# Altium project CamController3.PrjPcb
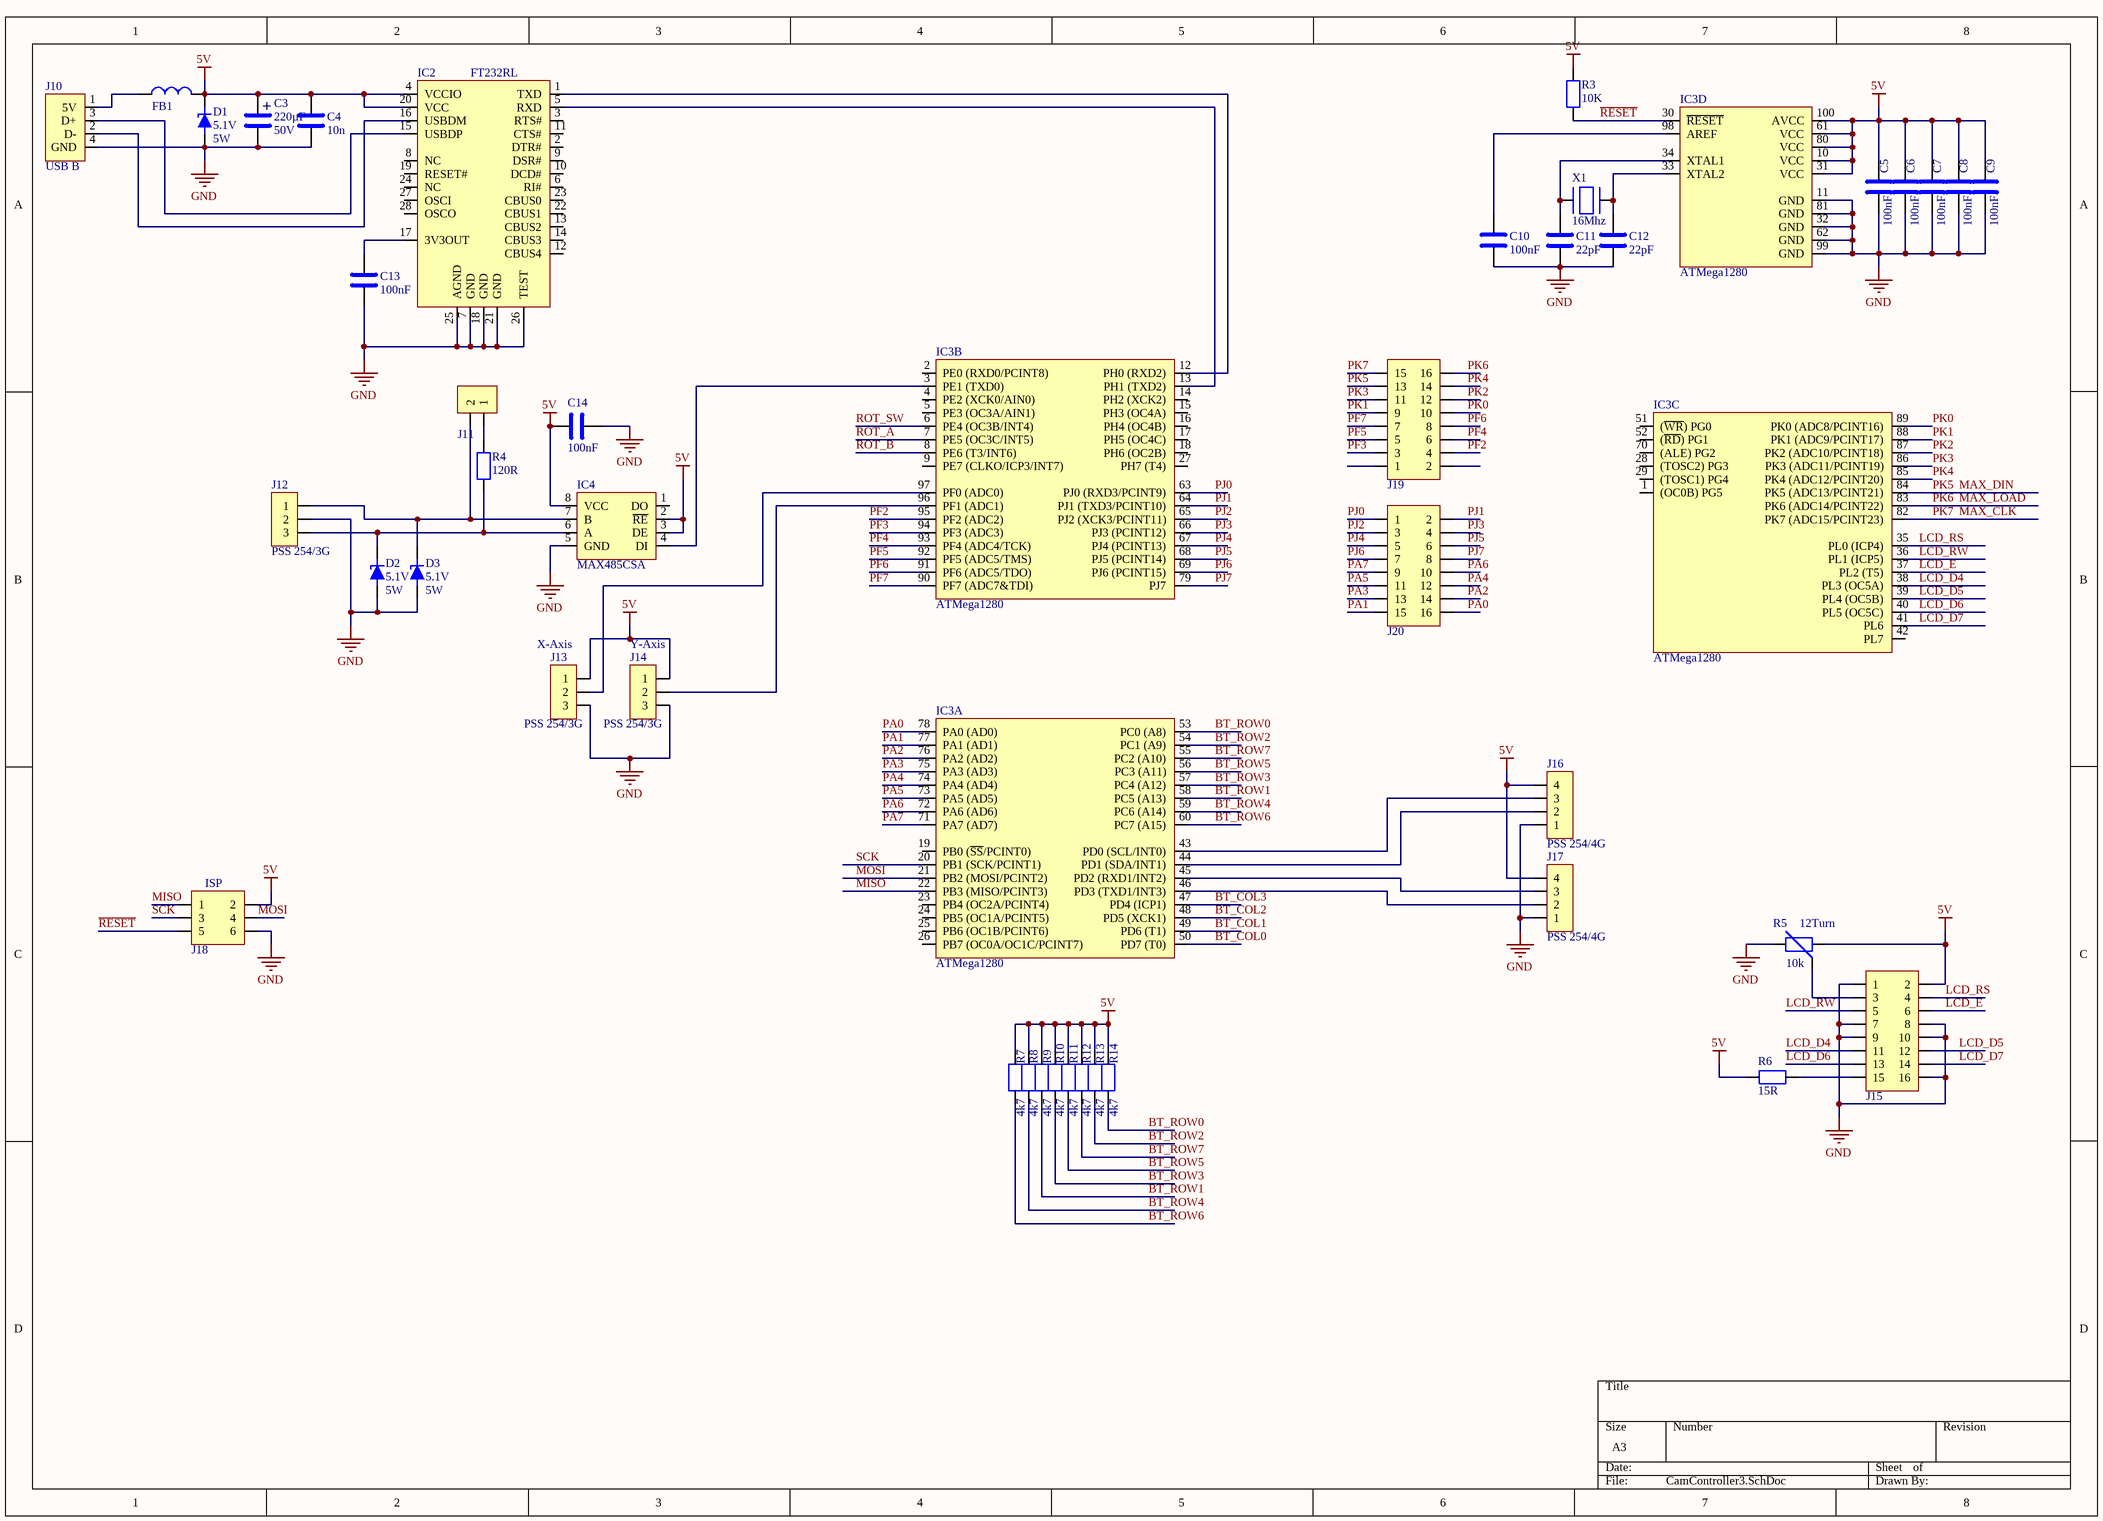
[diagram p0: CamController3.SchDoc]
2 sheets, 57 parts. Net scope: global (net labels, ports and power ports of the same name join across sheets).
Board file: CamController3.PcbDoc
Sheets:
  CamController3.SchDoc
  Buttoninterface.SchDoc

## Sheet CamController3.SchDoc
size A3

### Parts
C3  value 220µF  voltage: 50V  [RM5D125H20]  (hidden comment: Elko_220uF_50V)
C4  value 10n  [0805]  (hidden comment: 10nF 50V MLCC 0805)
C5  value 100nF  [0805]  (hidden comment: 100nF 50V MLCC 0805)
C6  value 100nF  [0805]  (hidden comment: 100nF 50V MLCC 0805)
C7  value 100nF  [0805]  (hidden comment: 100nF 50V MLCC 0805)
C8  value 100nF  [0805]  (hidden comment: 100nF 50V MLCC 0805)
C9  value 100nF  [0805]  (hidden comment: 100nF 50V MLCC 0805)
C10  value 100nF  [0805]  (hidden comment: 100nF 50V MLCC 0805)
C11  value 22pF  [0805]  (hidden comment: 22pF 50V MLCC 0805)
C12  value 22pF  [0805]  (hidden comment: 22pF 50V MLCC 0805)
C13  value 100nF  [0805]  (hidden comment: 100nF 50V MLCC 0805)
C14  value 100nF  [0805]  (hidden comment: 100nF 50V MLCC 0805)
D1  voltage: 5.1V  power: 5W  [DO-204AF]  (hidden comment: ZD-5W 5,1V)
D2  voltage: 5.1V  power: 5W  [DO-204AF]  (hidden comment: ZD-5W 5,1V)
D3  voltage: 5.1V  power: 5W  [DO-204AF]  (hidden comment: ZD-5W 5,1V)
FB1  Feritbead  [Ferritbead]  (value not drawn)
IC2  FT232RL  [SSOP-28]
IC3  ATMega1280  [LQFP100]  (parts A,B,C,D of 4)
IC4  MAX485CSA  [SOIC8]
J10  USB B  [USB_B]
J11  SL 1X2G 2,54  [SL_1x2 2.54mm]  (value not drawn)
J12  PSS 254/3G  [PSS 3pol]
J13  PSS 254/3G  [PSS 3pol]
J14  PSS 254/3G  [PSS 3pol]
J15  Wannenstecker 16pol 2,54mm  [WSL16G]  (value not drawn)
J16  PSS 254/4G  [PSS 4pol]
J17  PSS 254/4G  [PSS 4pol]
J18  Wannenstecker 6pol 2,54mm  [WSL6G]  (value not drawn)
J19  Wannenstecker 16pol 2,54mm  [WSL16G]  (value not drawn)
J20  Wannenstecker 16pol 2,54mm  [WSL16G]  (value not drawn)
R3  value 10K  [res0805]  (hidden comment: 10K 125mW 0805)
R4  value 120R  [res0805]  (hidden comment: 120R 125mW 0805)
R5  12Turn  value 10k  [64W]
R6  value 15R  [res0805]  (hidden comment: 15R 125mW 0805)
R7  value 4k7  [res0805]  (hidden comment: 4k7 125mW 0805)
R8  value 4k7  [res0805]  (hidden comment: 4k7 125mW 0805)
R9  value 4k7  [res0805]  (hidden comment: 4k7 125mW 0805)
R10  value 4k7  [res0805]  (hidden comment: 4k7 125mW 0805)
R11  value 4k7  [res0805]  (hidden comment: 4k7 125mW 0805)
R12  value 4k7  [res0805]  (hidden comment: 4k7 125mW 0805)
R13  value 4k7  [res0805]  (hidden comment: 4k7 125mW 0805)
R14  value 4k7  [res0805]  (hidden comment: 4k7 125mW 0805)
X1  Frequency: 16Mhz  [HC49]  (hidden comment: 8Mhz_HC49U)

### Nets
5V: C3.+ C4.1 C5.2 C6.2 C7.2 C8.2 C9.2 C14.1 D1.1 FB1.2 IC2.4(VCCIO) IC2.20(VCC) IC3.10(VCC) IC3.31(VCC) IC3.61(VCC) IC3.80(VCC) IC3.100(AVCC) IC4.2(~{RE}) IC4.3(DE) IC4.8(VCC) J13.1 J14.1 J15.2 J16.4 J17.4 J18.2 R3.2 R5.3 R6.2 R7.2 R8.2 R9.2 R10.2 R11.2 R12.2 R13.2 R14.2
GND: C3.- C4.2 C5.1 C6.1 C7.1 C8.1 C9.1 C10.1 C11.2 C12.2 C13.2 C14.2 D1.2 D2.2 D3.2 IC2.7(GND) IC2.18(GND) IC2.21(GND) IC2.25(AGND) IC2.26(TEST) IC3.11(GND) IC3.32(GND) IC3.62(GND) IC3.81(GND) IC3.99(GND) IC4.5(GND) J10.4(GND) J12.2 J13.3 J14.3 J15.1 J15.7 J15.8 J15.9 J15.10 J15.16 J16.1 J17.1 J18.6 R5.1
BT_COL0: IC3.50(PD7_(T0))
BT_COL1: IC3.49(PD6_(T1))
BT_COL2: IC3.48(PD5_(XCK1))
BT_COL3: IC3.47(PD4_(ICP1))
BT_ROW0: IC3.53(PC0_(A8)) R14.1
BT_ROW1: IC3.58(PC5_(A13)) R9.1
BT_ROW2: IC3.54(PC1_(A9)) R13.1
BT_ROW3: IC3.57(PC4_(A12)) R10.1
BT_ROW4: IC3.59(PC6_(A14)) R8.1
BT_ROW5: IC3.56(PC3_(A11)) R11.1
BT_ROW6: IC3.60(PC7_(A15)) R7.1
BT_ROW7: IC3.55(PC2_(A10)) R12.1
LCD_D4: IC3.38(PL3_(OC5A)) J15.11
LCD_D5: IC3.39(PL4_(OC5B)) J15.12
LCD_D6: IC3.40(PL5_(OC5C)) J15.13
LCD_D7: IC3.41(PL6) J15.14
LCD_E: IC3.37(PL2_(T5)) J15.6
LCD_RS: IC3.35(PL0_(ICP4)) J15.4
LCD_RW: IC3.36(PL1_(ICP5)) J15.5
MAX_CLK: IC3.82(PK7_(ADC15/PCINT23)) J19.15  [also labelled PK7]
MAX_DIN: IC3.84(PK5_(ADC13/PCINT21)) J19.13  [also labelled PK5]
MAX_LOAD: IC3.83(PK6_(ADC14/PCINT22)) J19.16  [also labelled PK6]
MISO: IC3.22(PB3_(MISO/PCINT3)) J18.1
MOSI: IC3.21(PB2_(MOSI/PCINT2)) J18.4
PA0: IC3.78(PA0_(AD0)) J20.16
PA1: IC3.77(PA1_(AD1)) J20.15
PA2: IC3.76(PA2_(AD2)) J20.14
PA3: IC3.75(PA3_(AD3)) J20.13
PA4: IC3.74(PA4_(AD4)) J20.12
PA5: IC3.73(PA5_(AD5)) J20.11
PA6: IC3.72(PA6_(AD6)) J20.10
PA7: IC3.71(PA7_(AD7)) J20.9
PF2: IC3.95(PF2_(ADC2)) J19.4
PF3: IC3.94(PF3_(ADC3)) J19.3
PF4: IC3.93(PF4_(ADC4/TCK)) J19.6
PF5: IC3.92(PF5_(ADC5/TMS)) J19.5
PF6: IC3.91(PF6_(ADC5/TDO)) J19.8
PF7: IC3.90(PF7_(ADC7&TDI)) J19.7
PJ0: IC3.63(PJ0_(RXD3/PCINT9)) J20.1
PJ1: IC3.64(PJ1_(TXD3/PCINT10)) J20.2
PJ2: IC3.65(PJ2_(XCK3/PCINT11)) J20.3
PJ3: IC3.66(PJ3_(PCINT12)) J20.4
PJ4: IC3.67(PJ4_(PCINT13)) J20.5
PJ5: IC3.68(PJ5_(PCINT14)) J20.6
PJ6: IC3.69(PJ6_(PCINT15)) J20.7
PJ7: IC3.79(PJ7) J20.8
PK0: IC3.89(PK0_(ADC8/PCINT16)) J19.10
PK1: IC3.88(PK1_(ADC9/PCINT17)) J19.9
PK2: IC3.87(PK2_(ADC10/PCINT18)) J19.12
PK3: IC3.86(PK3_(ADC11/PCINT19)) J19.11
PK4: IC3.85(PK4_(ADC12/PCINT20)) J19.14
~{RESET}: IC3.30(~{RESET}) J18.5 R3.1
ROT_A: IC3.7(PE5_(OC3C/INT5))
ROT_B: IC3.8(PE6_(T3/INT6))
ROT_SW: IC3.6(PE4_(OC3B/INT4))
SCK: IC3.20(PB1_(SCK/PCINT1)) J18.3
NetC10_2: C10.2 IC3.98(AREF)
NetC11_1: C11.1 IC3.34(XTAL1) X1.1
NetC12_1: C12.1 IC3.33(XTAL2) X1.2
NetC13_1: C13.1 IC2.17(3V3OUT)
NetD2_1: D2.1 IC4.6(A) J12.3 R4.1
NetD3_1: D3.1 IC4.7(B) J11.2 J12.1
NetFB1_1: FB1.1 J10.1(5V)
NetIC2_1: IC2.1(TXD) IC3.12(PH0_(RXD2))
NetIC2_5: IC2.5(RXD) IC3.13(PH1_(TXD2))
NetIC2_15: IC2.15(USBDP) J10.3(D+)
NetIC2_16: IC2.16(USBDM) J10.2(D-)
NetIC3_3: IC3.3(PE1_(TXD0)) IC4.4(DI)
NetIC3_43: IC3.43(PD0_(SCL/INT0)) J16.3
NetIC3_44: IC3.44(PD1_(SDA/INT1)) J16.2
NetIC3_45: IC3.45(PD2_(RXD1/INT2)) J17.3
NetIC3_46: IC3.46(PD3_(TXD1/INT3)) J17.2
NetIC3_96: IC3.96(PF1_(ADC1)) J14.2
NetIC3_97: IC3.97(PF0_(ADC0)) J13.2
NetJ11_1: J11.1 R4.2
NetJ15_3: J15.3 R5.2
NetJ15_15: J15.15 R6.1

Not connected (* = marked no-connect by the designer): IC2 2(DTR#) 3(RTS#) 6(RI#) 8(NC) 9(DSR#) 10(DCD#) 11(CTS#) 12(CBUS4) 13(CBUS2) 14(CBUS3) 19(RESET#) 22(CBUS1) 23(CBUS0) 24(NC) 27(OSCI) 28(OSCO); IC3 1((OC0B)_PG5) 2(PE0_(RXD0/PCINT8)) 4(PE2_(XCK0/AIN0)) 5(PE3_(OC3A/AIN1)) 9(PE7_(CLKO/ICP3/INT7)) 14(PH2_(XCK2)) 15(PH3_(OC4A)) 16(PH4_(OC4B)) 17(PH5_(OC4C)) 18(PH6_(OC2B)) 19(PB0_(~{SS}/PCINT0)) 23(PB4_(OC2A/PCINT4)) 24(PB5_(OC1A/PCINT5)) 25(PB6_(OC1B/PCINT6)) 26(PB7_(OC0A/OC1C/PCINT7)) 27(PH7_(T4)) 28((TOSC2)_PG3) 29((TOSC1)_PG4) 42(PL7) 51((~{WR})_PG0) 52((~{RD})_PG1) 70((ALE)_PG2); IC4 1(DO); J19 1 2

### Notes on the sheet
- (near J13) X-Axis
- (near J14) Y-Axis
- (near J18) ISP

### Library data of the parts
C3 = Elko_220uF_50V: nichicon; digikey code: 493-10876-3-ND
C4 = 10nF 50V MLCC 0805: Reichelt code: X7R-G0805 10N; dielectricum: X7R; voltage: 50V
C5-C10 C13 C14 = 100nF 50V MLCC 0805: Reichelt code: X7R-G0805 100N; dielectricum: X7R; voltage: 50V
C11 C12 = 22pF 50V MLCC 0805: Reichelt code: NPO-G0805 22p; dielectricum: NPO; voltage: 50V
FB1 = Feritbead: reichelt code: BEAD SMD-001
IC2 = FT 232 RL: USB UART Bridge; reichelt code: FT 232 RL
IC3 = ATmega1280: Reichelt code: ATMEGA 1280-16AU; datasheet: http://www.atmel.com/Images/Atmel-2549-8-bit-AVR-Microcontroller-ATmega640-1280-1281-2560-2561_datasheet.pdf
IC4 = MAX485CSA: RS485 driver; reichelt code: MAX 485 CSA
J10 = USB_B: reichelt code: USB BW
J11 = SL 1X2G 2,54: Stiftleiste 2pol 2.54mm; reichelt code: SL 1X50G 2,54
J12-J14 = PSS 254/3G: PSS 3pol wire-to-board-connector; reichelt code: PSS 254/3G
J15 J19 J20 = Wannenstecker 16pol 2,54mm: Reichelt code: WSL 16G
J16 J17 = PSS 254/4G: PSS 4pol wire-to-board-connector; reichelt code: PSS 254/4G
J18 = Wannenstecker 6pol 2,54mm: Reichelt code: WSL 6G
R3 = 10K 125mW 0805: Tolerance: 1%; Reichelt code: SMD-0805 10,0K; Power rating: 125mW
R4 = 120R 125mW 0805: Tolerance: 1%; Reichelt code: SMD-0805 120; Power rating: 125mW
R5 = 64W-10K: trimmer 12turn; reichelt code: 64W-10K
R6 = 15R 125mW 0805: Tolerance: 1%; Reichelt code: SMD-0805 15,0; Power rating: 125mW
R7-R14 = 4k7 125mW 0805: Tolerance: 1%; Reichelt code: SMD-0805 4,70K; Power rating: 125mW
X1 = 8Mhz_HC49U: 8Mhz crystal resonator; reichelt code: 16,0000-HC49U-S
D1-D3 = ZD-5W 5,1V: reichelt code: ZD-5W 5,1V

## Sheet Buttoninterface.SchDoc
size A4
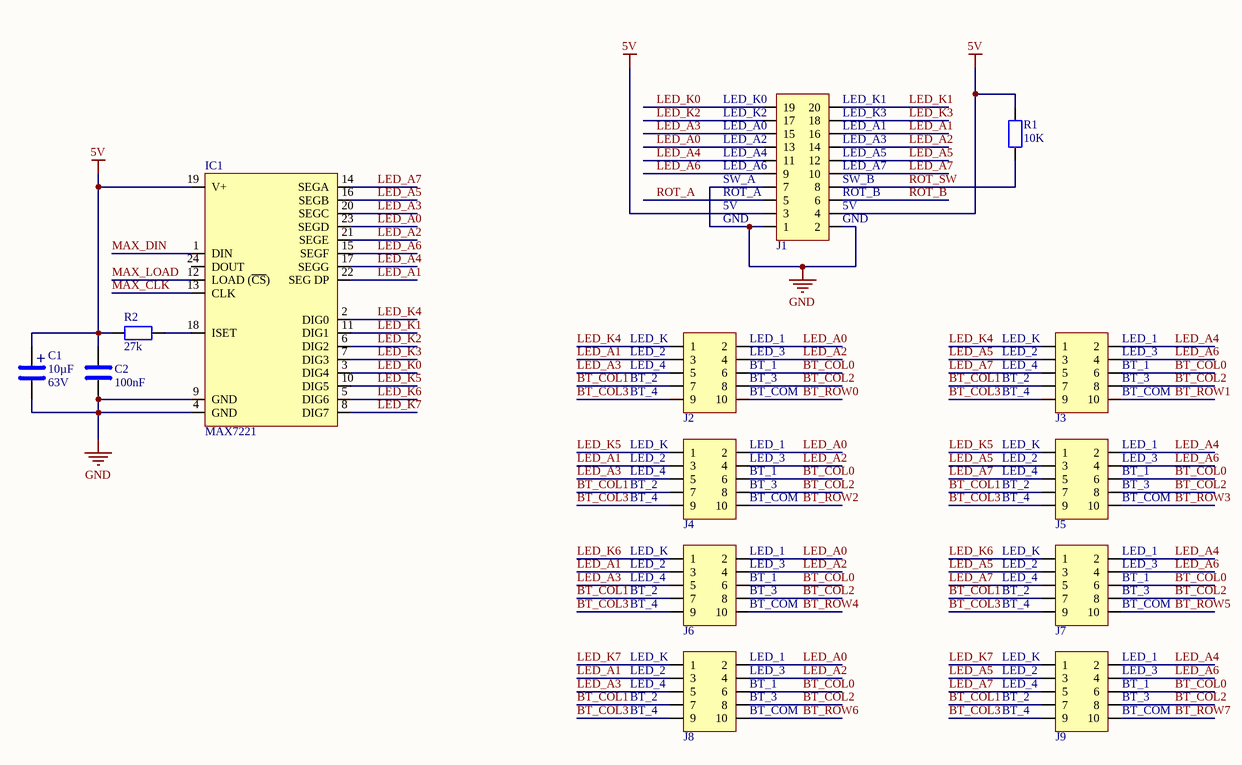
[diagram p1: Buttoninterface.SchDoc]

### Parts
C1  value 10µF  voltage: 63V  [RM2D5H11]  (hidden comment: Elko_10uF_63V)
C2  value 100nF  [0805]  (hidden comment: 100nF 50V MLCC 0805)
IC1  MAX7221  [DIL28]
J1  Wannenstecker 20pol 2,54mm  [WSL20G]  (value not drawn)
J2  Wannenstecker 10pol 2,54mm  [WSL10G]  (value not drawn)
J3  Wannenstecker 10pol 2,54mm  [WSL10G]  (value not drawn)
J4  Wannenstecker 10pol 2,54mm  [WSL10G]  (value not drawn)
J5  Wannenstecker 10pol 2,54mm  [WSL10G]  (value not drawn)
J6  Wannenstecker 10pol 2,54mm  [WSL10G]  (value not drawn)
J7  Wannenstecker 10pol 2,54mm  [WSL10G]  (value not drawn)
J8  Wannenstecker 10pol 2,54mm  [WSL10G]  (value not drawn)
J9  Wannenstecker 10pol 2,54mm  [WSL10G]  (value not drawn)
R1  value 10K  [res0805]  (hidden comment: 10K 125mW 0805)
R2  value 27k  [res0805]  (hidden comment: 27k 125mW 0805)

### Nets
5V: C1.+ C2.2 IC1.19(V+) J1.3 J1.4 R1.2 R2.2
GND: C1.- C2.1 IC1.4(GND) IC1.9(GND) J1.1 J1.2 J1.7
BT_COL0: J2.6 J3.6 J4.6 J5.6 J6.6 J7.6 J8.6 J9.6
BT_COL1: J2.7 J3.7 J4.7 J5.7 J6.7 J7.7 J8.7 J9.7
BT_COL2: J2.8 J3.8 J4.8 J5.8 J6.8 J7.8 J8.8 J9.8
BT_COL3: J2.9 J3.9 J4.9 J5.9 J6.9 J7.9 J8.9 J9.9
BT_ROW0: J2.10
BT_ROW1: J3.10
BT_ROW2: J4.10
BT_ROW3: J5.10
BT_ROW4: J6.10
BT_ROW5: J7.10
BT_ROW6: J8.10
BT_ROW7: J9.10
LED_A0: IC1.23(SEGD) J1.13 J2.2 J4.2 J6.2 J8.2
LED_A1: IC1.22(SEG_DP) J1.16 J2.3 J4.3 J6.3 J8.3
LED_A2: IC1.21(SEGE) J1.14 J2.4 J4.4 J6.4 J8.4
LED_A3: IC1.20(SEGC) J1.15 J2.5 J4.5 J6.5 J8.5
LED_A4: IC1.17(SEGG) J1.11 J3.2 J5.2 J7.2 J9.2
LED_A5: IC1.16(SEGB) J1.12 J3.3 J5.3 J7.3 J9.3
LED_A6: IC1.15(SEGF) J1.9 J3.4 J5.4 J7.4 J9.4
LED_A7: IC1.14(SEGA) J1.10 J3.5 J5.5 J7.5 J9.5
LED_K0: IC1.3(DIG4) J1.19
LED_K1: IC1.11(DIG1) J1.20
LED_K2: IC1.6(DIG2) J1.17
LED_K3: IC1.7(DIG3) J1.18
LED_K4: IC1.2(DIG0) J2.1 J3.1
LED_K5: IC1.10(DIG5) J4.1 J5.1
LED_K6: IC1.5(DIG6) J6.1 J7.1
LED_K7: IC1.8(DIG7) J8.1 J9.1
MAX_CLK: IC1.13(CLK)
MAX_DIN: IC1.1(DIN)
MAX_LOAD: IC1.12(LOAD_(~{CS}))
ROT_A: J1.5
ROT_B: J1.6
ROT_SW: J1.8 R1.1
NetIC1_18: IC1.18(ISET) R2.1

Not connected (* = marked no-connect by the designer): IC1 24(DOUT)

### Notes on the sheet
- (near J1) LED_K0
- (near J1) LED_K2
- (near J1) LED_A0
- (near J1) LED_A2
- (near J1) LED_K1
- (near J1) LED_K3
- (near J1) LED_A1
- (near J1) LED_A3
- (near J1) LED_A4
- (near J1) LED_A6
- (near J1) ROT_A
- (near J1) SW_A
- (near J1) 5V
- (near J1) LED_A5
- (near J1) LED_A7
- (near J1) ROT_B
- (near J1) SW_B
- (near J1) GND
- (near J2) LED_K
- (near J2) LED_1
- (near J3) LED_K
- (near J3) LED_1
- (near J2) LED_2
- (near J2) LED_4
- (near J2) BT_2
- (near J2) BT_4
- (near J2) LED_3
- (near J2) BT_1
- (near J2) BT_3
- (near J2) BT_COM
- (near J3) LED_2
- (near J3) LED_4
- (near J3) BT_2
- (near J3) BT_4
- (near J3) LED_3
- (near J3) BT_1
- (near J3) BT_3
- (near J3) BT_COM
- (near J4) LED_K
- (near J4) LED_2
- (near J4) LED_4
- (near J4) LED_1
- (near J4) LED_3
- (near J4) BT_1
- (near J5) LED_K
- (near J5) LED_2
- (near J5) LED_4
- (near J5) LED_1
- (near J5) LED_3
- (near J5) BT_1
- (near J4) BT_2
- (near J4) BT_4
- (near J6) LED_K
- (near J4) BT_3
- (near J4) BT_COM
- (near J6) LED_1
- (near J5) BT_2
- (near J5) BT_4
- (near J7) LED_K
- (near J5) BT_3
- (near J5) BT_COM
- (near J7) LED_1
- (near J6) LED_2
- (near J6) LED_4
- (near J6) BT_2
- (near J6) BT_4
- (near J6) LED_3
- (near J6) BT_1
- (near J6) BT_3
- (near J6) BT_COM
- (near J7) LED_2
- (near J7) LED_4
- (near J7) BT_2
- (near J7) BT_4
- (near J7) LED_3
- (near J7) BT_1
- (near J7) BT_3
- (near J7) BT_COM
- (near J8) LED_K
- (near J8) LED_2
- (near J8) LED_4
- (near J8) LED_1
- (near J8) LED_3
- (near J8) BT_1
- (near J9) LED_K
- (near J9) LED_2
- (near J9) LED_4
- (near J9) LED_1
- (near J9) LED_3
- (near J9) BT_1
- (near J8) BT_2
- (near J8) BT_4
- (near J8) BT_3
- (near J8) BT_COM
- (near J9) BT_2
- (near J9) BT_4
- (near J9) BT_3
- (near J9) BT_COM

### Library data of the parts
C1 = Elko_10uF_63V: reichelt code: RAD 105 10/63
C2 = 100nF 50V MLCC 0805: as C5 on sheet CamController3; voltage: 50V
IC1 = MAX7221CNG: 8x8 Matrix LED driver; reichelt code: MAX 7221 CNG
J1 = Wannenstecker 20pol 2,54mm: Reichelt code: WSL 20G
J2-J9 = Wannenstecker 10pol 2,54mm: Reichelt code: WSL 10G
R1 = 10K 125mW 0805: as R3 on sheet CamController3; Power rating: 125mW
R2 = 27k 125mW 0805: Tolerance: 1%; Reichelt code: SMD-0805 27,0K; Power rating: 125mW

## Nets that join several sheets
5V: CamController3 (37 pins), Buttoninterface (7 pins)
GND: CamController3 (40 pins), Buttoninterface (7 pins)
BT_COL0: CamController3 (IC3.50), Buttoninterface (8 pins)
BT_COL1: CamController3 (IC3.49), Buttoninterface (8 pins)
BT_COL2: CamController3 (IC3.48), Buttoninterface (8 pins)
BT_COL3: CamController3 (IC3.47), Buttoninterface (8 pins)
BT_ROW0: CamController3 (IC3.53 R14.1), Buttoninterface (J2.10)
BT_ROW1: CamController3 (IC3.58 R9.1), Buttoninterface (J3.10)
BT_ROW2: CamController3 (IC3.54 R13.1), Buttoninterface (J4.10)
BT_ROW3: CamController3 (IC3.57 R10.1), Buttoninterface (J5.10)
BT_ROW4: CamController3 (IC3.59 R8.1), Buttoninterface (J6.10)
BT_ROW5: CamController3 (IC3.56 R11.1), Buttoninterface (J7.10)
BT_ROW6: CamController3 (IC3.60 R7.1), Buttoninterface (J8.10)
BT_ROW7: CamController3 (IC3.55 R12.1), Buttoninterface (J9.10)
MAX_CLK: CamController3 (IC3.82 J19.15), Buttoninterface (IC1.13)
MAX_DIN: CamController3 (IC3.84 J19.13), Buttoninterface (IC1.1)
MAX_LOAD: CamController3 (IC3.83 J19.16), Buttoninterface (IC1.12)
ROT_A: CamController3 (IC3.7), Buttoninterface (J1.5)
ROT_B: CamController3 (IC3.8), Buttoninterface (J1.6)
ROT_SW: CamController3 (IC3.6), Buttoninterface (J1.8 R1.1)